# Altium schematic sheet DS1307.SchDoc
size A4
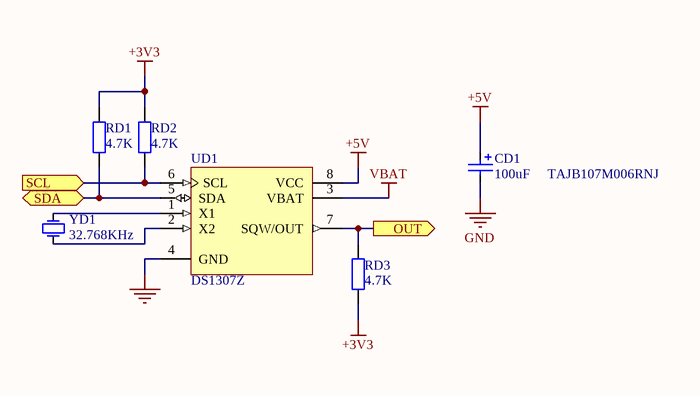
[diagram p0: DS1307.SchDoc]

## Parts
CD1  value 100uF     TAJB107M006RNJ  [CAP_TAN_B_3518]  (hidden comment: Cap_Tan)
RD1  value 4.7K  [RESC1608N]  (hidden comment: Res1)
RD2  value 4.7K  [RESC1608N]  (hidden comment: Res1)
RD3  value 4.7K  [RESC1608N]  (hidden comment: Res1)
UD1  DS1307Z  [SOIC8_L]
YD1  32.768KHz  [XTAL-206]

## Ports
OUT (out), SCL (in), SDA (bidir)

## Nets
+3V3: RD1.2 RD2.2 RD3.1
+5V: CD1.1 UD1.8(VCC)
GND: CD1.2 UD1.4(GND)
VBAT: UD1.3(VBAT)
OUT: RD3.2 UD1.7(SQW/OUT) ; port OUT
SCL: RD2.1 UD1.6(SCL) ; port SCL
SDA: RD1.1 UD1.5(SDA) ; port SDA
NetUD1_1: UD1.1(X1) YD1.2(OSC2)
NetUD1_2: UD1.2(X2) YD1.1(OSC1)

## Library data of the parts
CD1 = Cap_Tan: Capacitor
RD1-RD3 = Res1: Resistor; Published: 8-Jun-2000; LatestRevisionDate: 17-Jul-2002; LatestRevisionNote: Re-released for DXP Platform.; PackageReference: AXIAL-0.4; Publisher: Altium Limited
UD1 = DS1307Z: 64 X 8 Serial Real-Time Clock; Published: 13-Oct-2000; LatestRevisionDate: 13-Apr-2006; LatestRevisionNote: IPC-7351 Footprint Added.; DatasheetVersion: 10-Aug-1999; PackageVersion: 1999; PackageReference: SOIC8N; Publisher: Altium Limited; PackageDescription: 8-Pin Small Outline Integrated Circuit 1.27 mm Pitch; Code_IPC: SOIC127P600-8; ComponentLink1Description: Manufacturer Link; ComponentLink1URL: http://www.maxim-ic.com/; ComponentLink2Description: Datasheet; ComponentLink2URL: http://pdfserv.maxim-ic.com/en/ds/DS1307.pdf; ComponentLink3Description: Discontinuation Notice; ComponentLink3URL: http://www.maxim-ic.com/qa/pdfs/non-obsolescence-letter.pdf
YD1 = XTAL: Crystal Oscillator; Published: 8-Jun-2000; LatestRevisionDate: 17-Jul-2002; LatestRevisionNote: Re-released for DXP Platform.; PackageReference: R38; Publisher: Altium Limited; PackageDescription: Crystal, Thru-Hole; 2 Leads; Body 3.1 x 8.2 mm (Dia.xH)